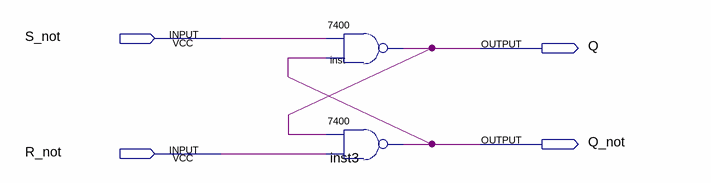
[diagram p0: schematic sheet]
// Quartus schematic sr_latch_nand.bdf as structural Verilog: 2 symbols, 4 pins
module sr_latch_nand (
  input  S_not,
  input  R_not,
  output Q,
  output Q_not
);

  \7400  inst (.\3 (Q_not), .\2 (S_not), .\1 (Q));
  \7400  inst3 (.\3 (R_not), .\2 (Q), .\1 (Q_not));
endmodule
